# Altium schematic sheet SDC_Driver.SchDoc
size 558 x 431 mm; SheetNumber: 3; SheetTotal: 6
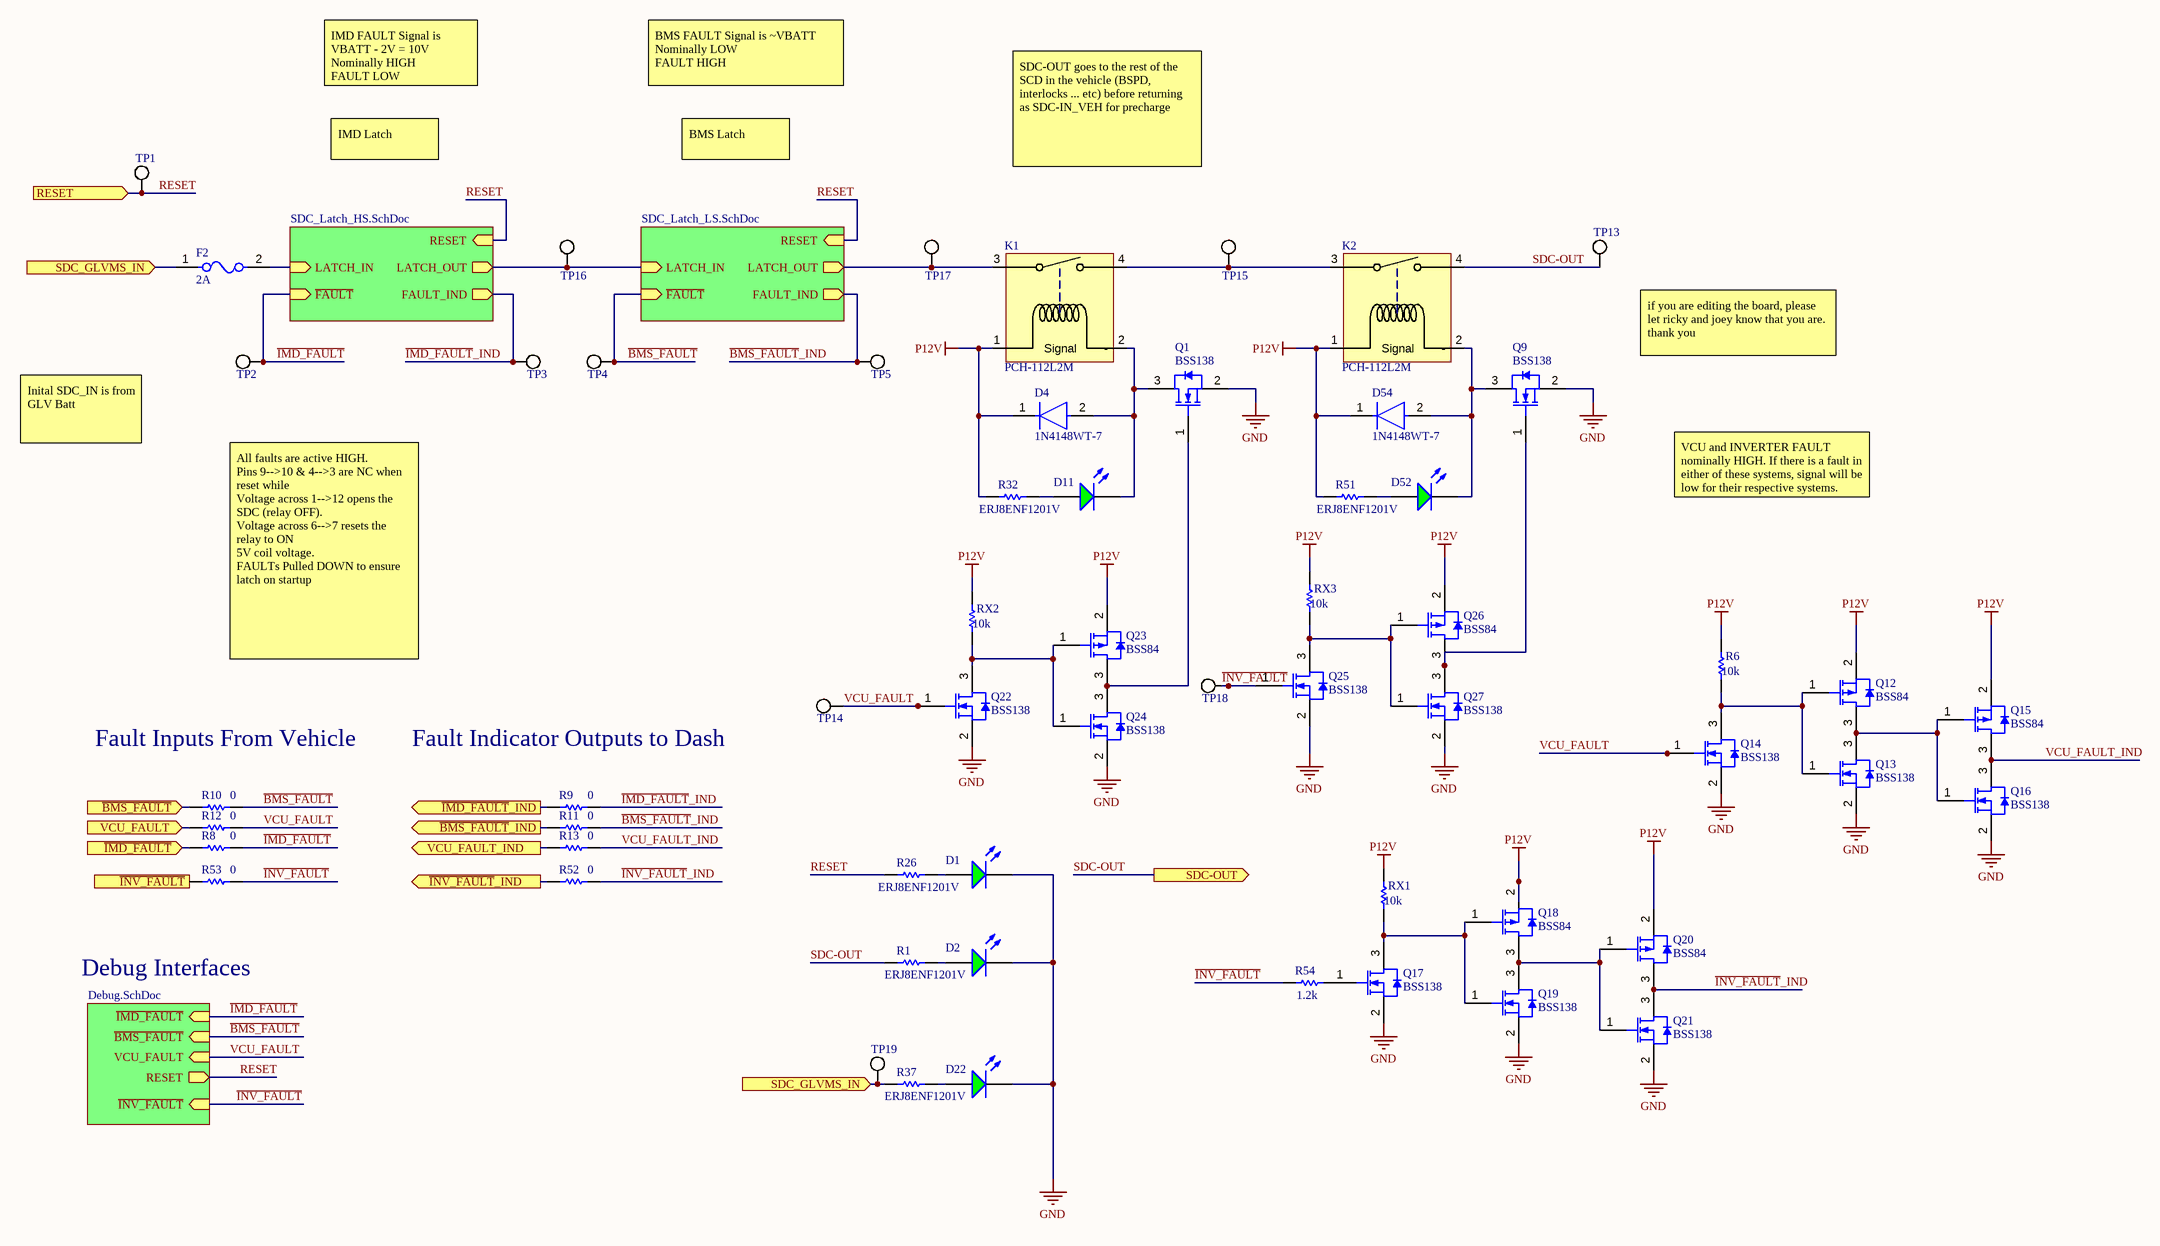
[diagram p0: SDC_Driver.SchDoc]

## Parts
D1  597-3311-407F  [DIAL-597-3311-407F_V]  (value not drawn)
D2  597-3311-407F  [DIAL-597-3311-407F_V]  (value not drawn)
D4  1N4148WT-7  [FP-SOD523-MFG]
D11  597-3311-407F  [DIAL-597-3311-407F_V]  (value not drawn)
D22  597-3311-407F  [DIAL-597-3311-407F_V]  (value not drawn)
D52  597-3311-407F  [DIAL-597-3311-407F_V]  (value not drawn)
D54  1N4148WT-7  [FP-SOD523-MFG]
F2  Fuse Current: 2A  [FP-0466-MFG]  (hidden comment: 0466002.NR)
K1  PCH-112L2M  [PCH-112L2M]
K2  PCH-112L2M  [PCH-112L2M]
Q1  BSS138  [FAIR-SOT23-3_V]
Q9  BSS138  [FAIR-SOT23-3_V]
Q12  BSS84  [FAIR-SOT23-3_V]
Q13  BSS138  [FAIR-SOT23-3_V]
Q14  BSS138  [FAIR-SOT23-3_V]
Q15  BSS84  [FAIR-SOT23-3_V]
Q16  BSS138  [FAIR-SOT23-3_V]
Q17  BSS138  [FAIR-SOT23-3_V]
Q18  BSS84  [FAIR-SOT23-3_V]
Q19  BSS138  [FAIR-SOT23-3_V]
Q20  BSS84  [FAIR-SOT23-3_V]
Q21  BSS138  [FAIR-SOT23-3_V]
Q22  BSS138  [FAIR-SOT23-3_V]
Q23  BSS84  [FAIR-SOT23-3_V]
Q24  BSS138  [FAIR-SOT23-3_V]
Q25  BSS138  [FAIR-SOT23-3_V]
Q26  BSS84  [FAIR-SOT23-3_V]
Q27  BSS138  [FAIR-SOT23-3_V]
R1  ERJ8ENF1201V  [RESC3216X70X50LL05T20]
R6  10k  [RESC3216X70X50LL20T25]
R8  value 0  [RESC3216X60X45ML15T20]  (hidden comment: Resistor 0R +/- 5% 1206 250 mW)
R9  value 0  [RESC3216X60X45ML15T20]  (hidden comment: Resistor 0R +/- 5% 1206 250 mW)
R10  value 0  [RESC3216X60X45ML15T20]  (hidden comment: Resistor 0R +/- 5% 1206 250 mW)
R11  value 0  [RESC3216X60X45ML15T20]  (hidden comment: Resistor 0R +/- 5% 1206 250 mW)
R12  value 0  [RESC3216X60X45ML15T20]  (hidden comment: Resistor 0R +/- 5% 1206 250 mW)
R13  value 0  [RESC3216X60X45ML15T20]  (hidden comment: Resistor 0R +/- 5% 1206 250 mW)
R26  ERJ8ENF1201V  [RESC3216X70X50LL05T20]
R32  ERJ8ENF1201V  [RESC3216X70X50LL05T20]
R37  ERJ8ENF1201V  [RESC3216X70X50LL05T20]
R51  ERJ8ENF1201V  [RESC3216X70X50LL05T20]
R52  value 0  [RESC3216X60X45ML15T20]  (hidden comment: Resistor 0R +/- 5% 1206 250 mW)
R53  value 0  [RESC3216X60X45ML15T20]  (hidden comment: Resistor 0R +/- 5% 1206 250 mW)
R54  1.2k  [RESC3216X70X50LL05T20]
RX1  10k  [RESC3216X70X50LL20T25]
RX2  10k  [RESC3216X70X50LL20T25]
RX3  10k  [RESC3216X70X50LL20T25]
TP1  Misc-Generic-TP  [FOOTPRINT-GENERIC-TP-VIA-1MM]  (value not drawn)
TP2  Misc-Generic-TP  [FOOTPRINT-GENERIC-TP-VIA-1MM]  (value not drawn)
TP3  Misc-Generic-TP  [FOOTPRINT-GENERIC-TP-VIA-1MM]  (value not drawn)
TP4  Misc-Generic-TP  [FOOTPRINT-GENERIC-TP-VIA-1MM]  (value not drawn)
TP5  Misc-Generic-TP  [FOOTPRINT-GENERIC-TP-VIA-1MM]  (value not drawn)
TP13  Misc-Generic-TP  [FOOTPRINT-GENERIC-TP-VIA-1MM]  (value not drawn)
TP14  Misc-Generic-TP  [FOOTPRINT-GENERIC-TP-VIA-1MM]  (value not drawn)
TP15  Misc-Generic-TP  [FOOTPRINT-GENERIC-TP-VIA-1MM]  (value not drawn)
TP16  Misc-Generic-TP  [FOOTPRINT-GENERIC-TP-VIA-1MM]  (value not drawn)
TP17  Misc-Generic-TP  [FOOTPRINT-GENERIC-TP-VIA-1MM]  (value not drawn)
TP18  Misc-Generic-TP  [FOOTPRINT-GENERIC-TP-VIA-1MM]  (value not drawn)
TP19  Misc-Generic-TP  [FOOTPRINT-GENERIC-TP-VIA-1MM]  (value not drawn)

## Sub-sheets
? = SDC_Latch_HS.SchDoc: ~{FAULT} (in), FAULT_IND (out), RESET (in), LATCH_IN (in), LATCH_OUT (out)
? = SDC_Latch_LS.SchDoc: ~{FAULT} (in), FAULT_IND (out), RESET (in), LATCH_IN (in), LATCH_OUT (out)
? = Debug.SchDoc: ~{IMD_FAULT} (in), ~{BMS_FAULT} (in), VCU_FAULT (in), RESET (out), ~{INV_FAULT} (in)

## Ports
RESET (in), SDC-OUT (out), SDC_GLVMS_IN (in), VCU_FAULT (in), VCU_FAULT_IND (out), ~{BMS_FAULT} (in), ~{BMS_FAULT}_IND (out), ~{IMD_FAULT} (in), ~{IMD_FAULT}_IND (out), ~{INV_FAULT} (in), ~{INV_FAULT}_IND (out)

## Nets
GND: D1.2(K) D2.2(K) D22.2(K) Q1.2(S) Q9.2(S) Q13.2(S) Q14.2(S) Q16.2(S) Q17.2(S) Q19.2(S) Q21.2(S) Q22.2(S) Q24.2(S) Q25.2(S) Q27.2(S)
P12V: D4.1(C) D54.1(C) K1.1(Signal) K2.1(Signal) Q12.2(SOURCE) Q15.2(SOURCE) Q18.2(SOURCE) Q20.2(SOURCE) Q23.2(SOURCE) Q26.2(SOURCE) R6.1 R32.1 R51.1 RX1.1 RX2.1 RX3.1
~{BMS_FAULT}: R10.2 TP4.1(TP) ; sheet /~{FAULT}, sheet /~{BMS_FAULT}
~{BMS_FAULT}: R10.1 ; port ~{BMS_FAULT}  [a separate net that carries the same name]
~{BMS_FAULT}_IND: R11.2 TP5.1(TP) ; sheet /FAULT_IND
~{BMS_FAULT}_IND: R11.1 ; port ~{BMS_FAULT}_IND  [a separate net that carries the same name]
~{IMD_FAULT}: R8.2 TP2.1(TP) ; sheet /~{FAULT}, sheet /~{IMD_FAULT}
~{IMD_FAULT}: R8.1 ; port ~{IMD_FAULT}  [a separate net that carries the same name]
~{IMD_FAULT}_IND: R9.2 TP3.1(TP) ; sheet /FAULT_IND
~{IMD_FAULT}_IND: R9.1 ; port ~{IMD_FAULT}_IND  [a separate net that carries the same name]
~{INV_FAULT}: Q25.1(G) R53.2 R54.1 TP18.1(TP) ; sheet /~{INV_FAULT}
~{INV_FAULT}: R53.1 ; port ~{INV_FAULT}  [a separate net that carries the same name]
~{INV_FAULT}_IND: Q20.3(DRAIN) Q21.3(D) R52.2
~{INV_FAULT}_IND: R52.1 ; port ~{INV_FAULT}_IND  [a separate net that carries the same name]
RESET: R26.1 TP1.1(TP) ; port RESET, sheet /RESET, sheet /RESET, sheet /RESET
SDC-OUT: K2.4(Switch_1) R1.1 TP13.1(TP) ; port SDC-OUT
SDC_GLVMS_IN: F2.1 R37.1 TP19.1(TP) ; port SDC_GLVMS_IN
VCU_FAULT: Q14.1(G) Q22.1(G) R12.2 TP14.1(TP) ; sheet /VCU_FAULT
VCU_FAULT: R12.1 ; port VCU_FAULT  [a separate net that carries the same name]
VCU_FAULT_IND: Q15.3(DRAIN) Q16.3(D) R13.2
VCU_FAULT_IND: R13.1 ; port VCU_FAULT_IND  [a separate net that carries the same name]
NetD1_1: D1.1(A) R26.2
NetD2_1: D2.1(A) R1.2
NetD4_2: D4.2(A) D11.2(K) K1.2(-) Q1.3(D)
NetD11_1: D11.1(A) R32.2
NetD22_1: D22.1(A) R37.2
NetD52_1: D52.1(A) R51.2
NetD52_2: D52.2(K) D54.2(A) K2.2(-) Q9.3(D)
NetF2_2: F2.2 ; sheet /LATCH_IN
NetK1_3: K1.3(Switch_1) TP17.1(TP) ; sheet /LATCH_OUT
NetK1_4: K1.4(Switch_1) K2.3(Switch_1) TP15.1(TP)
NetQ1_1: Q1.1(G) Q23.3(DRAIN) Q24.3(D)
NetQ9_1: Q9.1(G) Q26.3(DRAIN) Q27.3(D)
NetQ12_1: Q12.1(GATE) Q13.1(G) Q14.3(D) R6.2
NetQ12_3: Q12.3(DRAIN) Q13.3(D) Q15.1(GATE) Q16.1(G)
NetQ17_1: Q17.1(G) R54.2
NetQ17_3: Q17.3(D) Q18.1(GATE) Q19.1(G) RX1.2
NetQ18_3: Q18.3(DRAIN) Q19.3(D) Q20.1(GATE) Q21.1(G)
NetQ22_3: Q22.3(D) Q23.1(GATE) Q24.1(G) RX2.2
NetQ25_3: Q25.3(D) Q26.1(GATE) Q27.1(G) RX3.2
NetTP16_1: TP16.1(TP) ; sheet /LATCH_OUT, sheet /LATCH_IN

## Notes on the sheet
- IMD FAULT Signal is
  VBATT - 2V = 10V
  Nominally HIGH
  FAULT LOW
- BMS FAULT Signal is ~VBATT
  Nominally LOW
  FAULT HIGH
- IMD Latch
- BMS Latch
- SDC-OUT goes to the rest of the SCD in the vehicle (BSPD, interlocks ... etc) before returning as SDC-IN_VEH for precharge
- if you are editing the board, please let ricky and joey know that you are. thank you
- Inital SDC_IN is from GLV Batt
- VCU and INVERTER FAULT nominally HIGH. If there is a fault in either of these systems, signal will be low for their respective systems. Both signals are 3.3 volts
- All faults are active HIGH.
  Pins 9-->10 & 4-->3 are NC when reset while
  Voltage across 1-->12 opens the SDC (relay OFF).
  Voltage across 6-->7 resets the relay to ON
  5V coil voltage.
  FAULTs Pulled DOWN to ensure latch on startup
- Fault Inputs From Vehicle
- Fault Indicator Outputs to Dash
- Debug Interfaces
- Labels drawn without touching a wire or pin: \
- DWG. NO.
- REV.
- SHT.
- REVISION
- DESCRIPTION
- DATE
- APPROVED
- THIS DOCUMENT AND THE DATA DISCLOSED HEREIN OR HEREWITH IS THE PROPERTY OF ALTIUM LIMITED AND MAY BE FREELY DISTRIBUTED IN WHOLE. NO RIGHTS ARE RESERVED OR EXPRESS OR IMPLIED WARANTEE GIVEN.
- ENG:
- DSN:
- APPROVALS
- PROJECT
- DOCUMENT REVISION:
- DESIGN ITEM:
- CHK:
- BOM:
- REFERENCE DOCUMENTS
- PROJECT REVISION:
- TITLE
- FAB DWG:
- PCB DWG:
- ASSY DWG:
- SCALE:
- SIZE
- C
- CAGE CODE
- FILE NAME
- DWG NO.
- SHEET
- OF
- REV

## Library data of the parts
D1 D2 D11 D22 D52 = CMP-2000-05651-1: LED Green, 75 mW, 30 mA, -30 to 85 degC, 2-Pin SMD, RoHS, Tape and Reel; Manufacturer: Dialight; Product Depth (mm): 1.5mm; Viewing Angle: 70deg; DELETED: Compliant; Number of  Elements: 1; Emitting Color: YellowGreen; Shape Type: Rectangular; Product Length (mm): 3mm; Forward Current: 30mA; Main Category: ChipLED; Luminous Intensity: 7.5mcd; Type: Uni-Color; High Brightness: No; Test Current (It): 20mA; Lens Type: NonDiffused; Reverse Voltage: 4V; Peak Wavelength: 560nm; Power Dissipation: 75W; Forward Voltage: 2.5V; Chip Material: GaP; Mounting: SurfaceMount; Product Height (mm): 1.5mm; Pin Count: 2; Datasheet URL: https://datasheet.ciiva.com/15117/getdatasheetpartid-142484-15117764.pdf; Mounting Technology: SurfaceMount; Rad Hardened: No; Operating Temperature Classification: Commercial; Lens Dimensions: 2x1.5x0.9mm; Operating Temp Range: -30Cto85C; Package Reference: 597-3311-407F; Package Type: SMD; Datasheet Version: 07/2002; Lum Intensity: 7.5mcd; Packaging: TapeandReel; Package Description: 2-Pin Surface Mount Device, Body 1.5 x 3 mm; Manufacturer URL: http://www.dialight.com/
D4 D54 = CMP-2000-05518-3: DIODE GEN PURP 80V 125MA SOD523; Power Rating: 150mW; Peak Non-Repetitive Surge Current: 2A; Forward Voltage: 1.25V; Reverse Recovery Time: 4ns; Peak Reverse Current: 1uA; Max Repetitive Reverse Voltage (Vrrm): 100V; Capacitance: 2pF; Polarity: Standard; Element Configuration: Single; Forward Current: 250mA; Lead Free: Lead Free; Packaging: Tape and Reel; Length: 0.9mm; Min Operating Temperature: -65°C; Current Rating: 125mA; Max Reverse Voltage (DC): 80V; Width: 1.3mm; Package Quantity: 3000; Output Current: 125mA; Power Dissipation: 150mW; Max Operating Temperature: 150°C; Radiation Hardening: No; Average Rectified Current: 125mA; Height: 0.65mm; Voltage Rating (DC): 80V; Max Surge Current: 2A; Weight: 3.5E-05oz; Recovery Time: 4ns; Max Forward Surge Current (Ifsm): 2A; Contact Plating: Tin; Number of Pins: 2; Mount: Surface Mount; REACH SVHC: No SVHC
F2 = CMP-2000-05742-2: FUSE BOARD MNT 2A 63VAC/VDC 1206; Manufacturer: Littelfuse; Max Fuse Dc Voltage: 63V; Fuse I2T: 0.2326A2Sec; Fuse Voltage Drop: 78.73mV; Fuse Interrupt Ac Current: 50A; Resistance: 0.03Ω; Value: 0.03Ω; Fuse Blow Speed: Fast; Temperature Range Low: -55°C; Octopart: https://octopart.com/0466002.nr-littelfuse-566006; Category: Fuse; Digikey Description: FUSE BOARD MNT 2A 63VAC/VDC 1206; Height: 0.66mm; Temperature: -55°C to +90°C; ComponentLink2URL: https://www.littelfuse.com/~/media/electronics/datasheets/fuses/littelfuse_fuse_466_datasheet.pdf.pdf; Device Class L3: unset; Device Class L2: Fuses; Device Class L1: Circuit Protection; Lead Free: Yes; Mouser Description: 466 Series Very Fast-Acting 63 V 2 A 1206 Surface Mount Thin Film Fuse; Package: 0466; Temperature Range High: +90°C; Voltage Rating: 63V; Manufacturer Part Number: 0466002.NR; Automotive: No; Max Fuse Ac Voltage: 63V; ComponentLink2Description: Datasheet; RoHS: TRUE; Fuse Interrupt Dc Current: 50A
K1 K2 = CMP-042-000000-1: Relay SPST 5A 12VDC; Pin Count: 4; Source: Manufacturer-Specified.SchLib; Design Item ID: PCH-112L2M; Component Type: Standard; Datasheet: http://www.te.com/commerce/DocumentDelivery/DDEController?Action=srchrtrv&DocNm=PCH_series_relay_data_sheet_E&DocType=DS&DocLang=English
Q1 Q9 Q13 Q14 Q16 Q17 Q19 Q21 Q22 Q24 Q25 Q27 = CMP-013-00021-2: N-Channel Logic Level Enhancement Mode Field Effect Transistor, 220 mA, 50 V, -55 to 150 degC, 3-Pin SOT-23, RoHS, Tape and Reel; Manufacturer: Fairchild; Nominal Vgs: 1.3V; Rds On Max: 3.5Ohm; Nominal Dual Supply Voltage: 50V; Package Version: Rev. 12, 03/2016; Typical Rise Time: 9ns; Elements: 1; Power: 360mW; Input Capacitance: 27pF; Resistance: 0.7Ohm; Package Reference: SOT23-3; Package Quantity: 1; Pins: 3; Mounting Technology: SM; Datasheet URL: https://www.fairchildsemi.com/datasheets/BS/BSS138.pdf; Max Operating Temperature: 150°C; Min Operating Temperature: -55°C; Datasheet Version: Rev. C, 10/2005; Package Description: 3-Pin Small Outline Transistor, Body 2.92 x 1.325 mm, Pitch 0.95 mm; Case/Package: TO-236-3; Packaging: TapeandReel; RoHS Compliant: True
Q12 Q15 Q18 Q20 Q23 Q26 = CMP-013-00022-2: P-Channel Enhancement Mode Field-Effect Transistor, 0.13 A, 50 V, -55 to 150 degC, 3-Pin SOT23, RoHS, Tape and Reel; Manufacturer: Fairchild; Nominal Dual Supply Voltage: -50V; Input Capacitance: 73pF; Typical Rise Time: 6.3ns; Nominal Vgs: -1.7V; Elements: 1; Rds On Max: 10Ohm; Power: 360mW; Package Version: Rev. 12, 03/2016; Package Quantity: 3000; Package Reference: SOT23-3; RoHS Compliant: True; Mounting Technology: SM; Max Operating Temperature: 150°C; Datasheet URL: https://www.fairchildsemi.com/datasheets/BS/BSS84.pdf; Package Description: 3-Pin Small Outline Transistor, Body 2.92 x 1.325 mm, Pitch 0.95 mm; Datasheet Version: Rev. 1.1.0, 02/2013; Packaging: TapeandReel; Pins: 3; Min Operating Temperature: -55°C; Case/Package: TO-236-3
R1 R26 R32 R37 R51 = CMP-2003-00061-1: Manufacturer: Panasonic; Part Number: ERJ8ENF1201V
R6 RX1-RX3 = CMP-2003-04407-1: Manufacturer: Panasonic; Part Number: ERA8AEB103V
R8-R13 R52 R53 = CMP-009-00002-4: Chip Resistor, 0 Ohm, +/- 5%, 0.25 W, -55 to 155 degC, 1206 (3216 Metric); Voltage Rating: 200V; Power: 250mW; Case/Package: 1206; Mounting Technology: SM; RoHS Compliant: True; Min Operating Temperature: -55°C; Max Operating Temperature: 155°C; Tolerance: 5%; Pins: 2
R54 = CMP-2003-00061-1: ERJ8ENF1201V; Manufacturer: Panasonic; Part Number: ERJ8ENF1201V
TP1-TP5 TP13-TP19 = CMP-025-000000-1: Source: Generic.SchLib; Design Item ID: Misc-Generic-TP